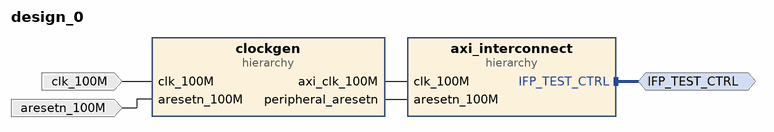
[diagram p0: block diagram of the top level]
# Vivado block design design_0, xczu15eg-ffvb1156-2-i, Vivado 2021.1
create_bd_design design_0

create_bd_intf_port -mode Master -vlnv xilinx.com:interface:aximm_rtl:1.0 IFP_TEST_CTRL
set_property -dict [list \
  CONFIG.ADDR_WIDTH 32 \
  CONFIG.CLK_DOMAIN design_0_zynq_ultra_ps_e_0_0_pl_clk0 \
  CONFIG.DATA_WIDTH 32 \
  CONFIG.FREQ_HZ 200000000 \
  CONFIG.HAS_BURST 0 \
  CONFIG.HAS_CACHE 0 \
  CONFIG.HAS_LOCK 0 \
  CONFIG.HAS_QOS 0 \
  CONFIG.HAS_REGION 0 \
  CONFIG.PROTOCOL AXI4LITE \
] [get_bd_intf_ports IFP_TEST_CTRL]
create_bd_port -dir I -type clk clk_100M
set_property -dict [list \
  CONFIG.ASSOCIATED_BUSIF IFP_TEST_CTRL \
  CONFIG.CLK_DOMAIN design_0_zynq_ultra_ps_e_0_0_pl_clk0 \
  CONFIG.FREQ_HZ 200000000 \
] [get_bd_ports clk_100M]
create_bd_port -dir I -type rst aresetn_100M
set_property -dict {CONFIG.POLARITY ACTIVE_LOW} [get_bd_ports aresetn_100M]

create_bd_cell -type hier clockgen
create_bd_cell -type hier axi_interconnect

# ---- hierarchy /clockgen ----
current_bd_instance /clockgen
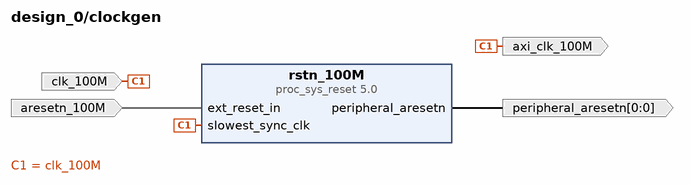
[diagram p1: block diagram inside /clockgen]
create_bd_pin -dir O -from 0 -to 0 -type rst peripheral_aresetn
create_bd_pin -dir I -type clk clk_100M
create_bd_pin -dir I -type rst aresetn_100M
create_bd_pin -dir O axi_clk_100M

create_bd_cell -type ip -vlnv xilinx.com:ip:proc_sys_reset:5.0 rstn_100M

# ---- hierarchy /axi_interconnect ----
current_bd_instance /axi_interconnect
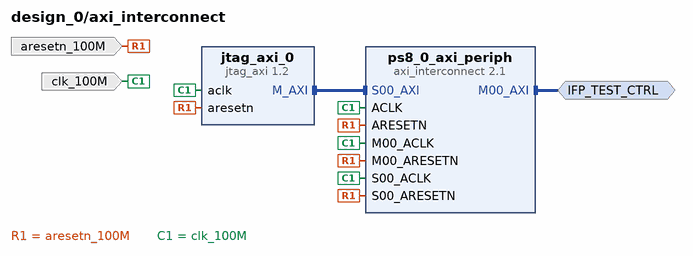
[diagram p2: block diagram inside /axi_interconnect]
create_bd_intf_pin -mode Master -vlnv xilinx.com:interface:aximm_rtl:1.0 IFP_TEST_CTRL
create_bd_pin -dir I -type clk clk_100M
create_bd_pin -dir I -type rst aresetn_100M

create_bd_cell -type ip -vlnv xilinx.com:ip:axi_interconnect:2.1 ps8_0_axi_periph
set_property -dict {CONFIG.NUM_MI 1 CONFIG.NUM_SI 1} [get_bd_cells ps8_0_axi_periph]
create_bd_cell -type ip -vlnv xilinx.com:ip:jtag_axi:1.2 jtag_axi_0

# ---- connections ----

current_bd_instance /clockgen
connect_bd_net -net ACLK_1 [get_bd_pins clk_100M] [get_bd_pins rstn_100M/slowest_sync_clk] [get_bd_pins axi_clk_100M]
connect_bd_net -net ARESETN_1 [get_bd_pins aresetn_100M] [get_bd_pins rstn_100M/ext_reset_in]
connect_bd_net -net proc_sys_reset_0_peripheral_aresetn [get_bd_pins rstn_100M/peripheral_aresetn] [get_bd_pins peripheral_aresetn]

current_bd_instance /axi_interconnect
connect_bd_intf_net [get_bd_intf_pins jtag_axi_0/M_AXI] [get_bd_intf_pins ps8_0_axi_periph/S00_AXI]
connect_bd_intf_net [get_bd_intf_pins IFP_TEST_CTRL] [get_bd_intf_pins ps8_0_axi_periph/M00_AXI]
connect_bd_net -net ARESETN_1 [get_bd_pins aresetn_100M] \
  [get_bd_pins ps8_0_axi_periph/ARESETN] [get_bd_pins jtag_axi_0/aresetn] [get_bd_pins ps8_0_axi_periph/M00_ARESETN] \
  [get_bd_pins ps8_0_axi_periph/S00_ARESETN]
connect_bd_net -net S00_ACLK_1 [get_bd_pins clk_100M] \
  [get_bd_pins ps8_0_axi_periph/S00_ACLK] [get_bd_pins ps8_0_axi_periph/M00_ACLK] [get_bd_pins ps8_0_axi_periph/ACLK] \
  [get_bd_pins jtag_axi_0/aclk]

current_bd_instance /
connect_bd_intf_net -intf_net axi_interconnect_IF_TEST_CTRL [get_bd_intf_ports IFP_TEST_CTRL] [get_bd_intf_pins axi_interconnect/IFP_TEST_CTRL]
connect_bd_net -net ACLK_1 [get_bd_ports clk_100M] [get_bd_pins clockgen/clk_100M]
connect_bd_net [get_bd_ports aresetn_100M] [get_bd_pins clockgen/aresetn_100M]
connect_bd_net [get_bd_pins clockgen/axi_clk_100M] [get_bd_pins axi_interconnect/clk_100M]
connect_bd_net [get_bd_pins clockgen/peripheral_aresetn] [get_bd_pins axi_interconnect/aresetn_100M]

# ---- address map ----
assign_bd_address -offset 0x00000000 -range 64K -target_address_space [get_bd_addr_spaces axi_interconnect/jtag_axi_0/Data] [get_bd_addr_segs IFP_TEST_CTRL/Reg]

validate_bd_design
save_bd_design
